# EAGLE design violin (EAGLE 9.6.2)
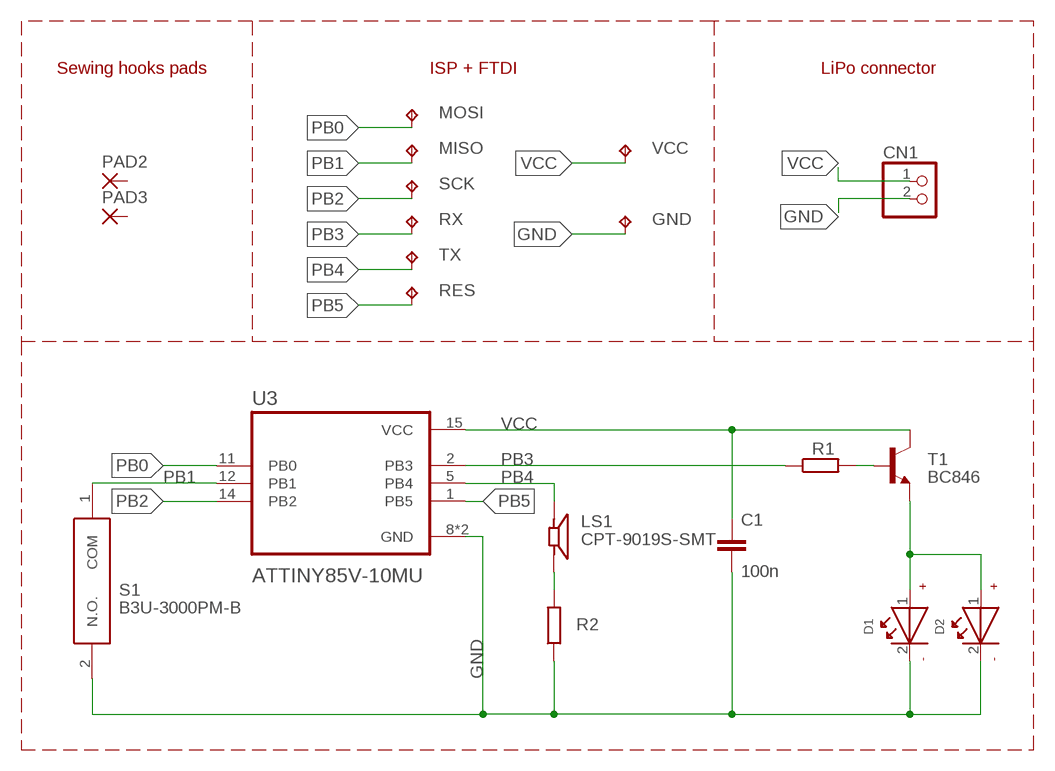
[diagram p0: schematic, sheet 1]

## Parts
C1  100n  C-EUC0603  [C0603]
CN1  JST_2PIN  [JSTPH2]
D1  WL-SMSW155124YS73200-Y  [WL-SMSW_1204]
D2  WL-SMSW155124YS73200-Y  [WL-SMSW_1204]
GND  TPTP11SQ  [TP11SQ]
LS1  CPT-9019S-SMT  [CUI_CPT-9019S-SMT]
MISO  TPTP11SQ  [TP11SQ]
MOSI  TPTP11SQ  [TP11SQ]
PAD2  SMD5  [SMD2,54-5,08]
PAD3  SMD2  [SMD1,27-2,54]
R1  R-EU_R0603  [R0603]
R2  R-EU_R0603  [R0603]
RES  TPTP11SQ  [TP11SQ]
RX  TPTP11SQ  [TP11SQ]
S1  B3U-3000PM-B  [B3U3000PMB]
SCK  TPTP11SQ  [TP11SQ]
T1  BC846  [SOT23]
TX  TPTP11SQ  [TP11SQ]
U3  ATTINY85V-10MU  [QFN50P400X400X80-21N]
VCC  TPTP11SQ  [TP11SQ]

## Nets
GND: C1.2 CN1.2 D1.2(-) D2.2(-) GND.TP R2.1 S1.2(N.O.) U3.8(GND) U3.21(GND)
N$1: LS1.2 R2.2
N$3: D1.1(+) D2.1(+) T1.2(E)
N$4: R1.2 T1.1(B)
PB0: MOSI.TP U3.11(PB0)
PB1: MISO.TP S1.1(COM) U3.12(PB1)
PB2: SCK.TP U3.14(PB2)
PB3: R1.1 RX.TP U3.2(PB3)
PB4: LS1.1 TX.TP U3.5(PB4)
PB5: RES.TP U3.1(PB5)
VCC: C1.1 CN1.1 T1.3(C) U3.15(VCC) VCC.TP
Unconnected: PAD2.1(P) PAD3.1(P)

## Notes on the sheet
- Sewing hooks pads | ISP + FTDI | LiPo connector

## Library data of the parts
C1 = rcl:C-EU: CAPACITOR, European symbol; SPICEPREFIX: C
CN1 = microbuilder:JST_2PIN: JST 2-Pin Right-Angle Connector PH-Series - 4UConnector: 17311 SH-Series - 4UConnector: 07278
D1 D2 = WL-SMSW:WL-SMSW: SMD Side view mono-color round Characteristics Low power consumption High reliability Low current requirement No UV/IR radiation Wide viewing angle Excelllent for edge lighting displays and backlighting indicators Ideal for miniature applications PBC high-usage Compatible with automatic placement equipment Applications Backlighting for LCD Sidelighting applications Indicator and backlighting for telecommunication Backlighting for symbol, switch and dashboard General use <http://katalog.we-online.de/media/images/eipal/WL-SMSW_pf2.jpg> Details see: http://katalog.we-online.de/en/led/WL-SMSW?m Updated: 2015-04-10 2015 (C) Wurth Elektronik; AVAILABILITY: Unavailable; DESCRIPTION: Yellow 589nm LED Indication - Discrete 2V 2-SMD, Side View; MF: Wurth Electronics; MP: 155124YS73200; PACKAGE: SMD-2 Würth Elektronik; PRICE: None
GND MISO MOSI RES RX SCK TX VCC = testpad:TP: Test pad
LS1 = CPT-9019S-SMT:CPT-9019S-SMT: 9 mm, 25 Vp-p Vdc, 65 dB, Surface Mount (SMT), Piezo Audio Transducer Buzzer; AVAILABILITY: Unavailable; CUI_PURCHASE_URL: https://www.cuidevices.com/product/audio/buzzers/audio-transducers/cpt-9019s-smt-tr?utm_source=snapeda.com&utm_medium=referral&utm_campaign=snapedaBOM; DESCRIPTION: 9 mm, 25 Vp-p Vdc, 65 dB, Surface Mount _SMT_, Piezo Audio Transducer Buzzer; MF: CUI Devices; MP: CPT-9019S-SMT-TR; PACKAGE: SIP-1 CUI; PRICE: None
PAD2 = wirepad:SMD5: SMD PAD
PAD3 = wirepad:SMD2: SMD PAD
R1 R2 = rcl:R-EU_: RESISTOR, European symbol; SPICEPREFIX: R
S1 = B3U-3000PM-B:B3U-3000PM-B: Tactile Switches Side Actuate w/Boss w/out Ground Term Source: Datasheet <https://www.mouser.com/datasheet/2/307/en-b3u-3615.pdf>; ALLIED_NUMBER: 71559348; ALLIED_PRICE-STOCK: https://www.alliedelec.com/omronelectroniccomponents-b3u-3000pm-b/71559348/; DESCRIPTION: Tactile Switches Side Actuate w/Boss w/out Ground Term; HEIGHT: 1.35mm; MANUFACTURER_NAME: Omron Electronics; MANUFACTURER_PART_NUMBER: B3U-3000PM-B; MOUSER_PART_NUMBER: 653-B3U-3000PM-B; MOUSER_PRICE-STOCK: https://www.mouser.com/Search/Refine.aspx?Keyword=653-B3U-3000PM-B
T1 = transistor:BC846: NPN TRANSISTOR
U3 = ATTINY85V-10MU:ATTINY85V-10MU: None; AVAILABILITY: Unavailable; DESCRIPTION: AVR AVR® ATtiny Microcontroller IC 8-Bit 10MHz 8KB _4K x 16_ FLASH 20-QFN-EP _4x4_; MF: Microchip; MP: ATTINY85V-10MU; PACKAGE: QFN-20 Microchip; PRICE: None

## Board
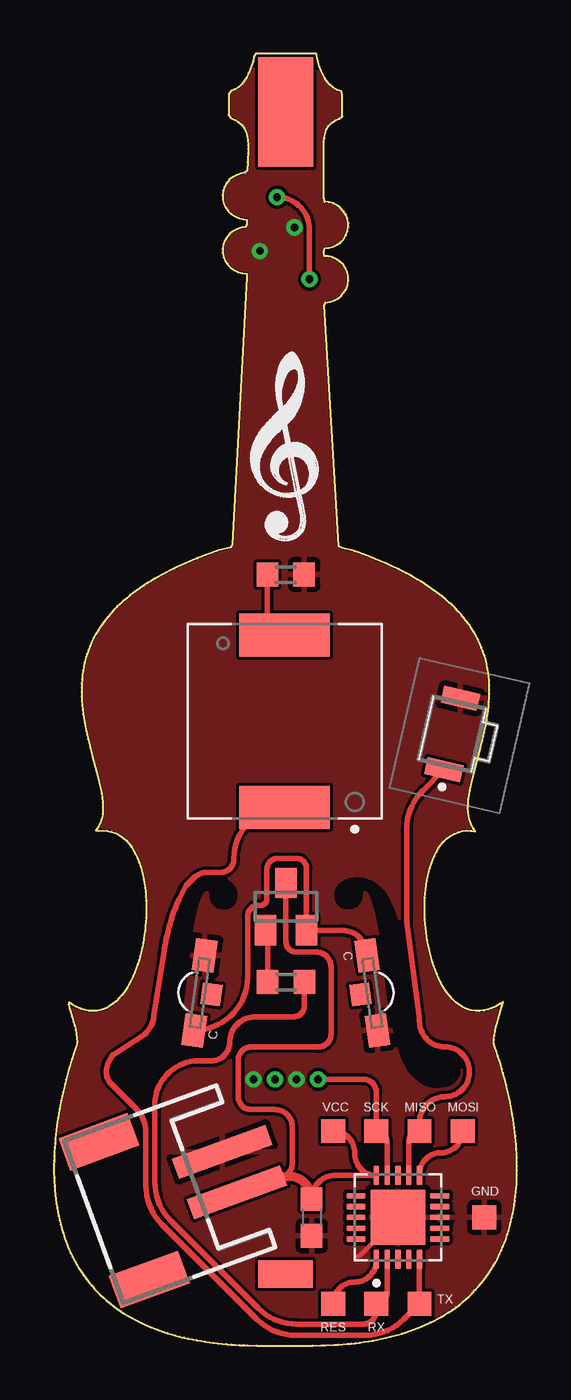
[diagram p1: board, top side]
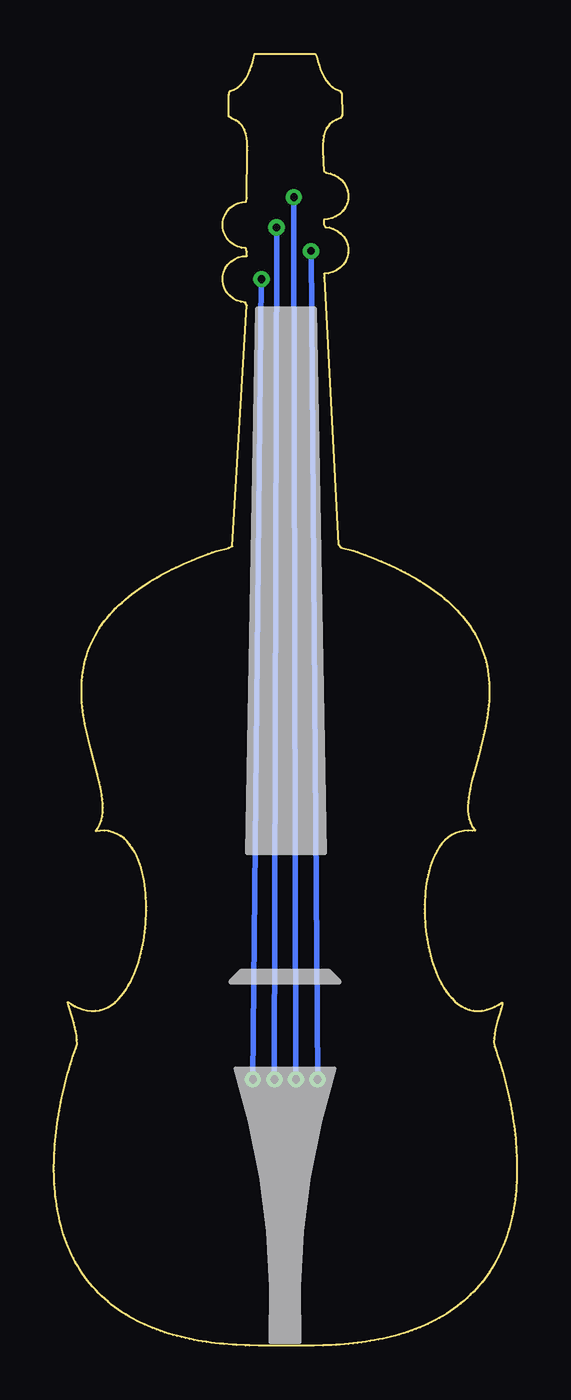
[diagram p2: board, bottom side, seen from below]

Size 21.46 x 59.88 mm. Coordinates in mm from the lower left corner, seen from the top.
Outline: 11.99,0 12.39,0.01 12.59,0.01 12.99,0.03 13.19,0.04 13.59,0.07 13.78,0.09 13.98,0.12 14.18,0.14 14.38,0.17 14.58,0.2 14.77,0.23 14.97,0.27 15.17,0.31 15.36,0.35 15.56,0.4 15.75,0.45 15.94,0.5 16.14,0.56 16.33,0.62 16.52,0.68 16.7,0.75 16.89,0.82 17.07,0.9 17.26,0.98 17.44,1.06 17.62,1.15 17.79,1.24 17.97,1.34 18.14,1.44 18.31,1.55 18.47,1.66 18.64,1.78 18.8,1.9 18.95,2.03 19.1,2.16 19.25,2.29 19.39,2.43 19.53,2.58 19.66,2.73 19.79,2.88 19.92,3.04 20.04,3.2 20.15,3.36 20.26,3.53 20.37,3.7 20.47,3.87 20.56,4.05 20.65,4.23 20.73,4.41 20.81,4.59 20.88,4.78 20.95,4.97 21.02,5.16 21.08,5.35 21.13,5.54 21.18,5.73 21.22,5.93 21.26,6.12 21.3,6.32 21.33,6.52 21.36,6.71 21.39,6.91 21.41,7.11 21.42,7.31 21.44,7.51 21.45,7.71 21.46,7.91 21.46,8.11 21.46,8.31 21.46,8.51 21.45,8.71 21.44,8.91 21.43,9.11 21.42,9.31 21.4,9.51 21.38,9.71 21.36,9.91 21.33,10.1 21.28,10.5 21.25,10.7 21.21,10.89 21.18,11.09 21.14,11.29 21.1,11.48 21.05,11.68 20.96,12.07 20.91,12.26 20.81,12.65 20.76,12.84 20.7,13.03 20.64,13.22 20.58,13.41 20.51,13.6 20.45,13.79 20.39,13.98 20.39,14.18 20.41,14.38 20.44,14.58 20.49,14.77 20.53,14.96 20.59,15.16 20.76,15.73 20.82,15.92 20.66,15.83 20.49,15.74 20.31,15.65 20.12,15.59 19.92,15.54 19.73,15.52 19.53,15.52 19.33,15.55 19.14,15.61 18.96,15.69 18.79,15.79 18.63,15.92 18.48,16.05 18.35,16.2 18.22,16.36 18.11,16.52 18.01,16.69 17.91,16.87 17.82,17.05 17.74,17.23 17.67,17.42 17.6,17.61 17.54,17.8 17.48,17.99 17.43,18.18 17.38,18.38 17.34,18.57 17.31,18.77 17.27,18.97 17.25,19.16 17.22,19.36 17.21,19.56 17.19,19.76 17.18,19.96 17.18,20.16 17.18,20.36 17.18,20.56 17.19,20.76 17.21,20.96 17.23,21.16 17.25,21.36 17.28,21.55 17.32,21.75 17.37,21.94 17.42,22.14 17.48,22.33 17.55,22.52 17.63,22.7 17.72,22.88 17.82,23.05 17.94,23.21 18.07,23.37 18.21,23.5 18.37,23.62 18.54,23.72 18.73,23.8 18.92,23.85 19.12,23.87 19.32,23.87 19.52,23.85 19.44,23.98 19.34,24.15 19.27,24.34 19.22,24.53 19.19,24.73 19.19,24.93 19.19,25.13 19.21,25.33 19.24,25.52 19.27,25.72 19.31,25.92 19.36,26.11 19.45,26.5 19.76,27.66 19.86,28.05 19.9,28.24 19.95,28.44 19.99,28.63 20.03,28.83 20.06,29.03 20.09,29.22 20.12,29.42 20.14,29.62 20.16,29.82 20.17,30.02 20.18,30.22 20.18,30.42 20.18,30.62 20.16,30.82 20.15,31.02 20.12,31.22 20.09,31.41 20.05,31.61 20,31.8 19.95,32 19.88,32.19 19.81,32.37 19.73,32.56 19.65,32.74 19.56,32.91 19.46,33.09 19.35,33.26 19.24,33.42 19.12,33.58 19,33.74 18.87,33.89 18.73,34.04 18.59,34.19 18.45,34.33 18.3,34.46 18.15,34.59 18,34.72 17.84,34.84 17.68,34.96 17.52,35.08 17.36,35.19 17.19,35.3 17.02,35.41 16.85,35.52 16.68,35.62 16.5,35.71 16.33,35.81 16.15,35.9 15.97,35.99 15.79,36.08 15.61,36.16 15.43,36.25 15.06,36.41 14.69,36.56 14.32,36.7 14.13,36.77 13.94,36.83 13.36,36.99 13.19,37.06 12.52,48.23 12.59,48.36 12.79,48.39 12.98,48.45 13.15,48.55 13.31,48.67 13.44,48.82 13.55,48.99 13.61,49.18 13.64,49.37 13.64,49.57 13.59,49.77 13.51,49.95 13.4,50.11 13.25,50.26 13.09,50.37 12.91,50.45 12.72,50.5 12.52,50.52 12.51,50.72 12.56,50.87 12.76,50.9 12.95,50.95 13.13,51.04 13.29,51.16 13.42,51.31 13.53,51.48 13.6,51.66 13.64,51.86 13.64,52.06 13.6,52.25 13.53,52.44 13.42,52.6 13.28,52.75 13.12,52.87 12.94,52.95 12.75,53.01 12.55,53.03 12.51,53.2 12.5,55.4 12.5,55.6 12.51,55.8 12.53,56 12.56,56.19 12.63,56.38 12.73,56.55 12.87,56.69 13.04,56.8 13.22,56.89 13.36,56.99 13.35,57.99 13.31,58.16 13.12,58.22 12.95,58.32 12.79,58.45 12.66,58.6 12.55,58.77 12.46,58.94 12.38,59.12 12.31,59.31 12.25,59.5 12.2,59.7 12.16,59.88 9.36,59.88 9.27,59.75 9.23,59.56 9.17,59.36 9.11,59.18 9.03,58.99 8.94,58.81 8.83,58.64 8.71,58.49 8.56,58.35 8.39,58.24 8.21,58.17 8.11,58.05 8.1,57.05 8.19,56.91 8.37,56.83 8.54,56.73 8.7,56.6 8.82,56.45 8.9,56.27 8.96,56.07 8.98,55.88 9,55.68 9,55.48 9,55.28 8.99,55.08 8.98,54.88 8.95,54.48 8.85,54.37 8.65,54.34 8.46,54.27 8.29,54.17 8.14,54.05 8.01,53.9 7.91,53.72 7.84,53.53 7.81,53.34 7.83,53.14 7.87,52.94 7.96,52.76 8.08,52.6 8.22,52.46 8.39,52.35 8.57,52.27 8.76,52.23 8.95,52.19 8.95,51.99 8.88,51.86 8.68,51.83 8.49,51.77 8.32,51.68 8.16,51.55 8.02,51.41 7.92,51.24 7.85,51.05 7.82,50.85 7.82,50.65 7.86,50.46 7.94,50.27 8.06,50.11 8.2,49.97 8.36,49.85 8.54,49.77 8.73,49.72 8.93,49.7 8.94,49.51 8.27,37.13 8.17,37.01 7.59,36.85 7.4,36.8 7.03,36.66 6.65,36.51 6.28,36.36 6.1,36.28 5.92,36.2 5.74,36.11 5.56,36.02 5.38,35.94 5.2,35.84 5.02,35.75 4.85,35.65 4.67,35.55 4.5,35.45 4.33,35.35 4.17,35.24 4,35.13 3.84,35.01 3.68,34.89 3.52,34.77 3.36,34.64 3.21,34.51 3.06,34.38 2.92,34.24 2.78,34.1 2.64,33.95 2.51,33.8 2.39,33.64 2.27,33.48 2.15,33.32 2.04,33.15 1.94,32.98 1.84,32.8 1.76,32.63 1.68,32.44 1.6,32.26 1.54,32.07 1.48,31.88 1.43,31.68 1.38,31.49 1.35,31.29 1.32,31.09 1.3,30.89 1.29,30.69 1.28,30.5 1.28,30.3 1.28,30.1 1.29,29.9 1.31,29.7 1.33,29.5 1.36,29.3 1.39,29.1 1.42,28.9 1.46,28.71 1.5,28.51 1.54,28.32 1.58,28.12 1.68,27.73 1.78,27.35 1.99,26.57 2.09,26.19 2.13,25.99 2.17,25.8 2.21,25.6 2.24,25.4 2.26,25.2 2.27,25 2.27,24.8 2.25,24.6 2.21,24.41 2.15,24.22 2.06,24.04 1.94,23.88 2.06,23.86 2.26,23.87 2.46,23.86 2.66,23.82 2.85,23.76 3.03,23.67 3.19,23.55 3.34,23.42 3.47,23.27 3.59,23.11 3.7,22.94 3.8,22.77 3.88,22.59 3.95,22.4 4.02,22.21 4.07,22.02 4.12,21.82 4.16,21.63 4.19,21.43 4.22,21.23 4.24,21.03 4.26,20.84 4.27,20.64 4.28,20.44 4.28,20.24 4.28,20.04 4.27,19.84 4.26,19.64 4.24,19.44 4.22,19.24 4.2,19.04 4.16,18.84 4.13,18.65 4.09,18.45 4.05,18.25 4,18.06 3.94,17.87 3.88,17.68 3.82,17.49 3.75,17.3 3.67,17.12 3.58,16.94 3.49,16.76 3.39,16.59 3.28,16.42 3.16,16.26 3.03,16.11 2.89,15.97 2.74,15.84 2.57,15.73 2.39,15.64 2.2,15.57 2.01,15.53 1.81,15.51 1.61,15.53 1.41,15.57 1.22,15.63 1.04,15.7 0.86,15.8 0.69,15.9 0.67,15.8 0.73,15.61 0.85,15.23 0.9,15.04 0.96,14.84 1,14.65 1.04,14.45 1.06,14.26 1.07,14.06 1.04,13.86 0.97,13.67 0.91,13.48 0.84,13.29 0.78,13.1 0.72,12.91 0.67,12.72 0.56,12.34 0.51,12.14 0.42,11.75 0.38,11.56 0.34,11.36 0.3,11.17 0.26,10.97 0.23,10.77 0.19,10.57 0.16,10.38 0.14,10.18 0.11,9.98 0.09,9.78 0.07,9.58 0.05,9.38 0.03,9.18 0.02,8.99 0.01,8.79 0,8.59 0,8.39 0,8.19 0,7.99 0.01,7.79 0.02,7.59 0.03,7.39 0.04,7.19 0.06,6.99 0.09,6.79 0.11,6.59 0.14,6.39 0.18,6.2 0.22,6 0.26,5.81 0.31,5.61 0.36,5.42 0.42,5.23 0.48,5.04 0.55,4.85 0.62,4.66 0.7,4.48 0.78,4.3 0.87,4.12 0.96,3.94 1.05,3.76 1.16,3.59 1.26,3.42 1.38,3.26 1.49,3.1 1.62,2.94 1.74,2.78 1.88,2.63 2.01,2.49 2.16,2.35 2.3,2.21 2.45,2.08 2.6,1.95 2.76,1.83 2.92,1.71 3.09,1.59 3.25,1.48 3.42,1.38 3.6,1.28 3.77,1.19 3.95,1.09 4.13,1.01 4.31,0.93 4.5,0.85 4.68,0.77 4.87,0.71 5.06,0.64 5.25,0.58 5.44,0.52 5.64,0.47 5.83,0.42 6.02,0.37 6.22,0.32 6.41,0.28 6.61,0.25 6.81,0.21 7,0.18 7.2,0.15 7.4,0.13 7.6,0.1 7.8,0.08 8,0.06 8.2,0.05 8.4,0.03 8.6,0.02 8.8,0.01 9,0.01 9.39,0 11.99,0
Copper layers (1*16): Top 0.035mm / dielectric 1.5mm / Bottom 0.035mm
Design rules "default *": minimum track width 6mil, minimum drill 0.35mm, track to track 6mil, track to pad 6mil, pad to pad 6mil, via to via 6mil, smd to smd 6mil, copper to edge 1mil, drill to drill 5mil, minimum pad ring 10mil, minimum via ring 8mil, stop-mask expansion 4mil, vias tented up to drill 0mil, thermal gap 10mil
tRestrict: area 2.7,12 to 8.5,21.7; area 13,12 to 18.8,21.7; area 13,12 to 18.8,21.7
bRestrict: area 13,12 to 18.8,21.7; area 13,12 to 18.8,21.7; area 2.7,12 to 8.5,21.7

### Footprints (pad centres in the part's own frame; a part is rotated, then mirrored left to right if it is on the bottom)
C0603 = smd 1.1 x 1: 1 -0.85,0; 2 0.85,0
JSTPH2 = smd 1 x 4.6: 1 -1,-3.7; 2 1,-3.7 | smd 1.6 x 3.4: NC1 -3.4,1.5; NC2 3.4,1.5
WL-SMSW_1204 = smd 1.5 x 1: 1 -1.75,0; 2 1.75,0 | smd 1 x 0.9: 3 0,-0.55
TP11SQ = smd 1.1 x 1.1: TP 0,0
CUI_CPT-9019S-SMT = smd 4.2 x 2: 1 0,4; 2 0,-4
SMD2,54-5,08 = smd 2.54 x 5.08: 1 0,0
SMD1,27-2,54 = smd 1.27 x 2.54: 1 0,0
R0603 = smd 1 x 1.1: 1 -0.85,0; 2 0.85,0
B3U3000PMB = smd 0.8 x 1.7: 1 1.7,0; 2 -1.7,0
SOT23 = smd 1 x 1.4: 1 -0.95,-1.1; 2 0.95,-1.1; 3 0,1.1
QFN50P400X400X80-21N = smd 0.89 x 0.26: 1 -1.945,1; 2 -1.945,0.5; 3 -1.945,0; 4 -1.945,-0.5; 5 -1.945,-1; 11 1.945,-1; 12 1.945,-0.5; 13 1.945,0; 14 1.945,0.5; 15 1.945,1 | smd 0.26 x 0.89: 6 -1,-1.945; 7 -0.5,-1.945; 8 0,-1.945; 9 0.5,-1.945; 10 1,-1.945; 16 1,1.945; 17 0.5,1.945; 18 0,1.945; 19 -0.5,1.945; 20 -1,1.945 | smd 2.54 x 2.54: 21 0,0

### Placement (x,y rotation side)
C1  11.94,5.94 270 top
CN1  4.66,6.77 110.1 top
D1  6.75,16.36 82 top
D2  14.75,16.36 278 top
GND  19.94,5.94 180 top
LS1  10.69,28.94 180 top
MISO  16.94,9.94 180 top
MOSI  18.94,9.94 180 top
PAD2  10.74,57.19 0 top
PAD3  10.73,3.32 270 top
R1  10.75,16.86 180 top
R2  10.74,35.74 180 top
RES  12.94,1.94 0 top
RX  14.94,1.94 180 top
S1  18.45,28.36 257 top
SCK  14.94,9.94 180 top
T1  10.75,20.36 0 top
TX  16.94,1.94 0 top
U3  15.94,5.94 90 top
VCC  12.94,9.94 180 top

### Tracks (layer width: path | path; a pad name or v marks a point on that pad's centre or on a via)
GND  (via drill 0.35)
  Top 0.203: U3.21 14.21,4.21 arc-45 14.05,4.15
  Bottom 0.254: v9.24,12.34 v9.54,50.74 | v11.14,51.84 v11.24,12.34
  pour Top (rank 3): -0.06,-0.06 21.94,-0.06 21.94,59.94 0.94,59.94 -0.06,59.94
N$1
  Top 0.254: R2.2 9.89,33.74 arc90 LS1.2
N$3
  Top 0.254: D2.1 arc90 13.34,19.26 T1.2 arc-90 T1.2 11.7,22.14 arc90 11.25,22.59 10.38,22.59 arc90 9.87,22.08 9.87,20.71 arc-90 9.57,20.41 9.5,20.41 arc90 8.97,19.89 8.97,17.09 arc-90 D1.1
N$4
  Top 0.254: T1.1 arc-90 9.9,19.16 R1.2
PB0
  Top 0.254: U3.11 16.94,7.94 arc-90 17.94,8.94 arc90 MOSI.TP
PB1
  Top 0.254: U3.12 16.44,9.44 arc-90 MISO.TP 16.94,10.34 arc-90 18.14,11.54 arc90 19.24,12.64 19.24,12.74 arc90 18.14,13.84 arc-90 16.94,15.04 16.94,15.24 16.34,19.64 16.34,23.92 arc-45 17.09,25.71 S1.1
PB2  (via drill 0.35)
  Top 0.254: U3.14 15.44,9.44 arc90 SCK.TP 14.94,11.74 arc90 14.34,12.34 v12.24,12.34 | v10.34,53.24 arc-90 11.84,51.74 v11.84,49.44
  Bottom 0.254: v10.24,12.34 v10.34,53.24 | v12.24,12.34 v11.84,49.44
PB3
  Top 0.254: U3.2 15.44,2.44 arc-90 RX.TP 14.94,1.61 arc-90 14.33,0.99 11.26,0.99 arc-45 9.46,1.73 5.42,5.78 arc-45 4.67,7.58 4.67,11.17 arc-90 6.71,13.2 7.3,13.2 arc90 8.14,14.04 arc-90 9.34,15.24 11.1,15.24 arc90 11.6,15.74 R1.1
PB4
  Top 0.254: U3.5 TX.TP 16.22,1.22 arc-45 14.42,0.48 11.2,0.48 arc-45 9.4,1.22 5,5.62 arc-45 4.26,7.41 4.26,9.91 arc45 3.82,10.96 2.66,12.13 arc-45 2.43,12.69 arc-45 2.75,13.48 4.22,14.42 arc45 4.64,15.44 5.08,18.16 5.08,18.19 5.1,18.3 5.12,18.39 5.13,18.46 5.14,18.53 5.16,18.61 5.17,18.68 5.18,18.75 5.19,18.75 5.21,18.88 5.23,18.95 5.24,19.02 5.27,19.14 5.29,19.21 5.3,19.28 5.34,19.43 5.34,19.44 5.36,19.5 5.38,19.57 5.41,19.67 5.43,19.74 5.45,19.81 5.47,19.87 5.49,19.93 5.51,19.99 5.53,20.06 5.54,20.06 5.56,20.14 5.59,20.2 5.61,20.27 | 5.61,20.27 | 5.61,20.27 5.64,20.34 5.67,20.4 5.68,20.44 | 5.68,20.44 | 5.68,20.44 5.69,20.45 5.69,20.47 5.71,20.51 5.73,20.54 5.74,20.56 5.74,20.57 5.76,20.61 5.78,20.64 5.78,20.66 5.79,20.67 6.14,21.34 6.46,21.66 arc-45 7.14,21.94 7.74,21.94 arc90 8.34,22.54 8.34,22.59 arc-90 LS1.1
PB5
  Top 0.254: U3.1 14.94,3.94 arc-90 13.94,2.94 arc90 RES.TP
VCC
  Top 0.254: VCC.TP arc-90 13.94,8.94 13.94,8.89 arc90 U3.15 13.04,7.89 arc90 C1.1 | T1.3 10.75,18.71 arc90 11.22,18.25 12.14,18.25 arc-90 12.84,17.54 12.84,14.44 arc-90 12.24,13.84 9.14,13.84 arc90 8.54,13.24 8.54,11.54 arc90 9.14,10.94 10.24,10.94 arc-90 11.04,10.14 11.04,8.43 arc-90 10.4,7.79
  Top 0.406: C1.1 arc90 10.89,7.84 10.54,7.84 10.4,7.79 CN1.1

### Text on the board
tPlace: VCC | SCK | MISO | MOSI | GND | TX | RES | RX